# Altium schematic sheet LPCB230 - OVERVIEW.SchDoc
size A3; Address1: Factory 10; Address2: 9-13 Dingley Avenue, Dandeong, VICTORIA 3175, AUSTRALIA; DocumentNumber: 1; Revision: 1; SheetNumber: 1; SheetTotal: 3; Lockie__PCB_SUB_ASSEMBLY: Overview; Lockie__PCB_ASSEMBLY: Interface; Lockie__LDL: LPCB230; Lockie__PCB_DESCRIPTION: Thermocouple Interface
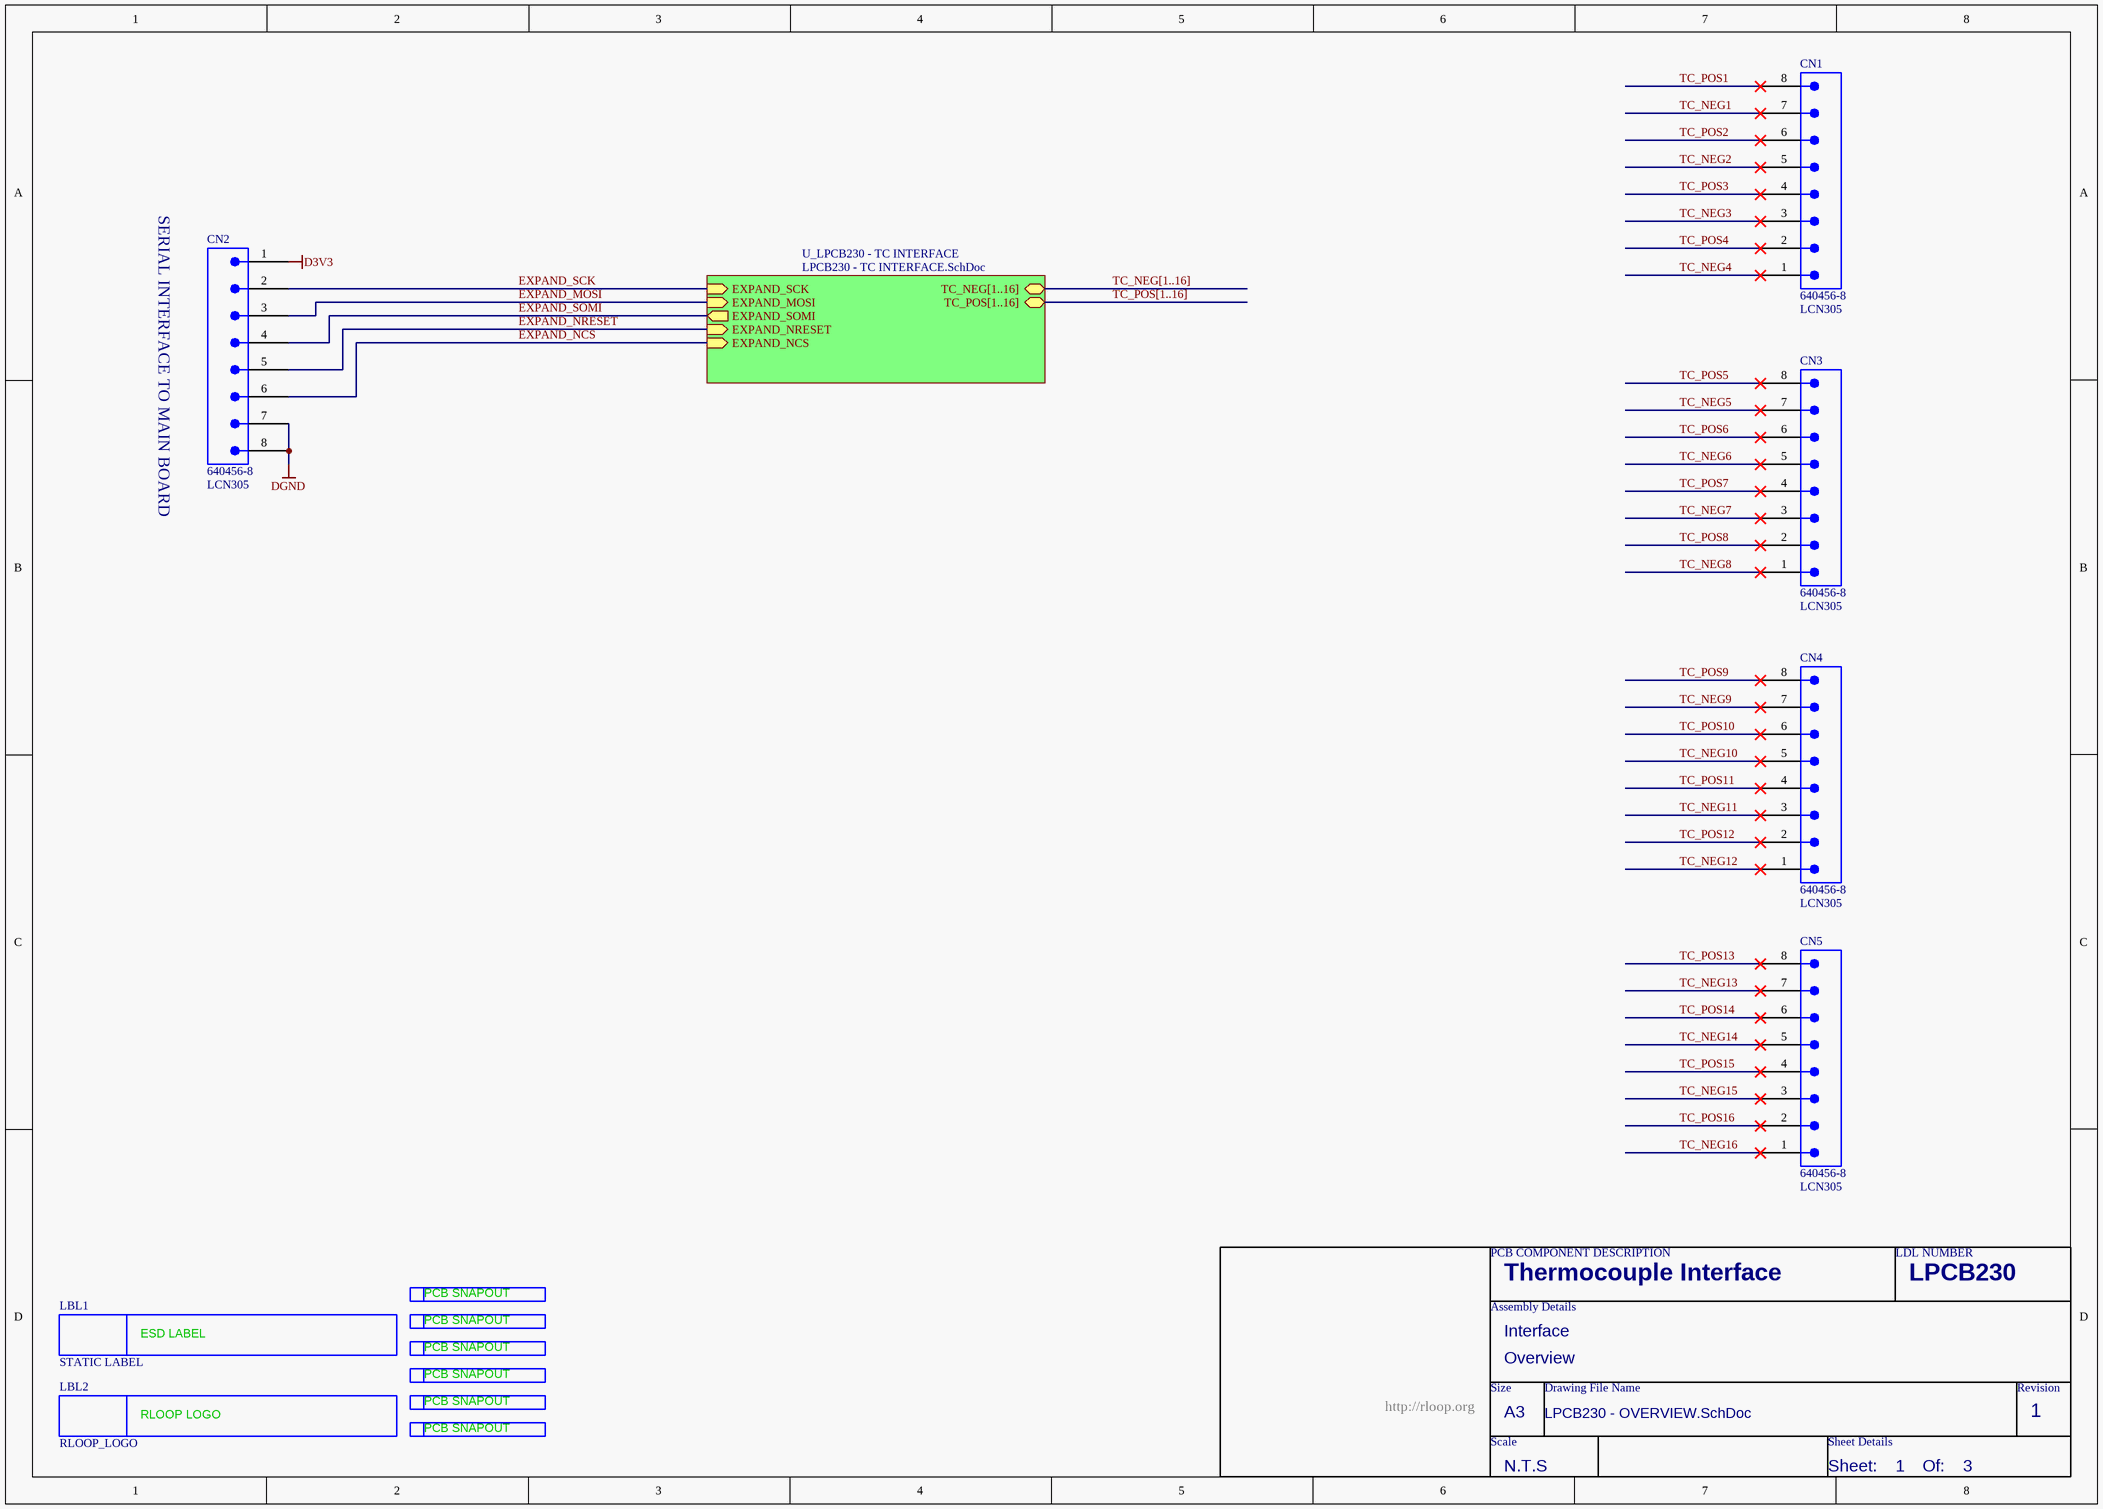
[diagram p0: LPCB230 - OVERVIEW.SchDoc]

## Parts
CN1  640456-8  LDL_NUMBER: LCN305  [640456-8]
CN2  640456-8  LDL_NUMBER: LCN305  [640456-8]
CN3  640456-8  LDL_NUMBER: LCN305  [640456-8]
CN4  640456-8  LDL_NUMBER: LCN305  [640456-8]
CN5  640456-8  LDL_NUMBER: LCN305  [640456-8]
LBL1  STATIC LABEL  [STATIC_LABEL]  (no BOM)
LBL2  RLOOP_LOGO  [RLOOP_LOGO]  (no BOM)
SN1  PCB_SNAPOUT  [SNAPOUT_NEW]  (value not drawn)  (no BOM)
SN2  PCB_SNAPOUT  [SNAPOUT_NEW]  (value not drawn)  (no BOM)
SN3  PCB_SNAPOUT  [SNAPOUT_NEW]  (value not drawn)  (no BOM)
SN4  PCB_SNAPOUT  [SNAPOUT_NEW]  (value not drawn)  (no BOM)
SN5  PCB_SNAPOUT  [SNAPOUT_NEW]  (value not drawn)  (no BOM)
SN6  PCB_SNAPOUT  [SNAPOUT_NEW]  (value not drawn)  (no BOM)

## Sub-sheets
U_LPCB230 - TC INTERFACE = LPCB230 - TC INTERFACE.SchDoc: EXPAND_SCK (in), EXPAND_MOSI (in), EXPAND_SOMI (out), EXPAND_NCS (in), EXPAND_NRESET (in), TC_NEG[1..16] (bidir), TC_POS[1..16] (bidir)

## Nets
D3V3: CN2.1
DGND: CN2.7 CN2.8
EXPAND_MOSI: CN2.3 ; sheet U_LPCB230 - TC INTERFACE/EXPAND_MOSI
EXPAND_NCS: CN2.6 ; sheet U_LPCB230 - TC INTERFACE/EXPAND_NCS
EXPAND_NRESET: CN2.5 ; sheet U_LPCB230 - TC INTERFACE/EXPAND_NRESET
EXPAND_SCK: CN2.2 ; sheet U_LPCB230 - TC INTERFACE/EXPAND_SCK
EXPAND_SOMI: CN2.4 ; sheet U_LPCB230 - TC INTERFACE/EXPAND_SOMI
TC_NEG1: CN1.7
TC_NEG2: CN1.5
TC_NEG3: CN1.3
TC_NEG4: CN1.1
TC_NEG5: CN3.7
TC_NEG6: CN3.5
TC_NEG7: CN3.3
TC_NEG8: CN3.1
TC_NEG9: CN4.7
TC_NEG10: CN4.5
TC_NEG11: CN4.3
TC_NEG12: CN4.1
TC_NEG13: CN5.7
TC_NEG14: CN5.5
TC_NEG15: CN5.3
TC_NEG16: CN5.1
TC_POS1: CN1.8
TC_POS2: CN1.6
TC_POS3: CN1.4
TC_POS4: CN1.2
TC_POS5: CN3.8
TC_POS6: CN3.6
TC_POS7: CN3.4
TC_POS8: CN3.2
TC_POS9: CN4.8
TC_POS10: CN4.6
TC_POS11: CN4.4
TC_POS12: CN4.2
TC_POS13: CN5.8
TC_POS14: CN5.6
TC_POS15: CN5.4
TC_POS16: CN5.2

## Buses and harness runs
bus TC_NEG[1..16] = sheet U_LPCB230 - TC INTERFACE/TC_NEG[1..16]
bus TC_POS[1..16] = sheet U_LPCB230 - TC INTERFACE/TC_POS[1..16]

## Notes on the sheet
- SERIAL INTERFACE TO MAIN BOARD
- PCB COMPONENT DESCRIPTION
- LDL NUMBER
- Assembly Details
- Size
- Drawing File Name
- Revision
- http://rloop.org
- Scale
- A3
- Sheet Details
- N.T.S
- Sheet:
- Of:
- (in symbol PCB_SNAPOUT) PCB SNAPOUT
- (in symbol RLOOP_LOGO) RLOOP LOGO
- (in symbol STATIC LABEL) ESD LABEL

## Library data of the parts
CN1-CN5 = 640456-8: Connector, Male Header, 8 Way; FMEDA__CHANNEL: COM; FMEDA__OPERATING__CURRENT_MAX: 0; FMEDA__OPERATING__TEMP_MAX: 50; FMEDA__OPERATING__TEMP_MIN: -20; FMEDA__OPERATING__TEMP_TYP: 27; FMEDA__OPERATING__VOLTAGE_MAX: 16; FMEDA__OPERATING__VOLTAGE_TYP: 12; FMEDA__FUNCTION_IN_SYSTEM: *; FMEDA__OPERATING__CURRENT_MIN: 0; FMEDA__OPERATING__CURRENT_TYP: 0; FMEDA__OPERATING__VOLTAGE_MIN: 0
LBL1 = STATIC LABEL: FMEDA__CHANNEL: DIAG; FMEDA__FUNCTION_IN_SYSTEM: *
LBL2 = RLOOP_LOGO: FMEDA__CHANNEL: DIAG; FMEDA__FUNCTION_IN_SYSTEM: *
SN1-SN6 = PCB_SNAPOUT: FMEDA__CHANNEL: DIAG; FMEDA__FUNCTION_IN_SYSTEM: *